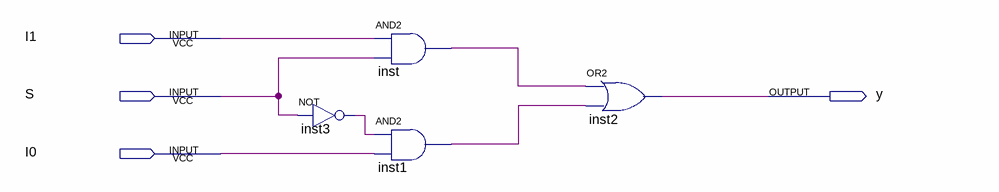
[diagram p0: schematic sheet]
// Quartus schematic MuxDemo.bdf as structural Verilog: 4 symbols, 4 pins
module MuxDemo (
  input  I1,
  input  S,
  input  I0,
  output y
);

  wire inst1_out, inst3_out, inst_out;

  not inst3 (inst3_out, S);
  and inst (inst_out, I1, S);
  and inst1 (inst1_out, inst3_out, I0);
  or inst2 (y, inst_out, inst1_out);
endmodule
